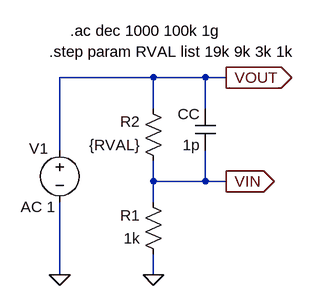
[diagram p0: schematic fig-03-01-52.asc]
fig-03-01-52.asc, the LTspice schematic file:
Version 4
SHEET 1 1172 680
WIRE 192 96 48 96
WIRE 272 96 192 96
WIRE 304 96 272 96
WIRE 192 144 192 96
WIRE 272 144 272 96
WIRE 48 208 48 96
WIRE 192 256 192 224
WIRE 272 256 272 208
WIRE 272 256 192 256
WIRE 304 256 272 256
WIRE 192 288 192 256
WIRE 48 400 48 288
WIRE 192 400 192 368
FLAG 48 400 0
FLAG 304 96 VOUT
IOPIN 304 96 Out
FLAG 192 400 0
FLAG 304 256 VIN
IOPIN 304 256 Out
SYMBOL voltage 48 192 R0
WINDOW 3 -107 200 Left 2
WINDOW 123 -60 103 Left 2
WINDOW 39 0 0 Left 0
WINDOW 0 -47 13 Left 2
SYMATTR Value ""
SYMATTR Value2 AC 1
SYMATTR InstName V1
SYMBOL res 208 240 R180
WINDOW 0 36 76 Left 2
WINDOW 3 36 40 Left 2
SYMATTR InstName R2
SYMATTR Value {RVAL}
SYMBOL res 208 384 R180
WINDOW 0 36 76 Left 2
WINDOW 3 36 40 Left 2
SYMATTR InstName R1
SYMATTR Value 1k
SYMBOL cap 288 208 R180
WINDOW 0 24 56 Left 2
WINDOW 3 24 8 Left 2
SYMATTR InstName CC
SYMATTR Value 1p
TEXT 64 24 Left 2 !.ac dec 1000 100k 1g
TEXT 32 56 Left 2 !.step param RVAL list 19k 9k 3k 1k

The netlist it stands for:
* fig-03-01-52.asc
V1 VOUT 0 AC 1
R2 VIN VOUT {RVAL}
R1 0 VIN 1k
CC VIN VOUT 1p
.ac dec 1000 100k 1g
.step param RVAL list 19k 9k 3k 1k
.backanno
.end